# EAGLE schematic Microduino-NEO6M (EAGLE 6.3)
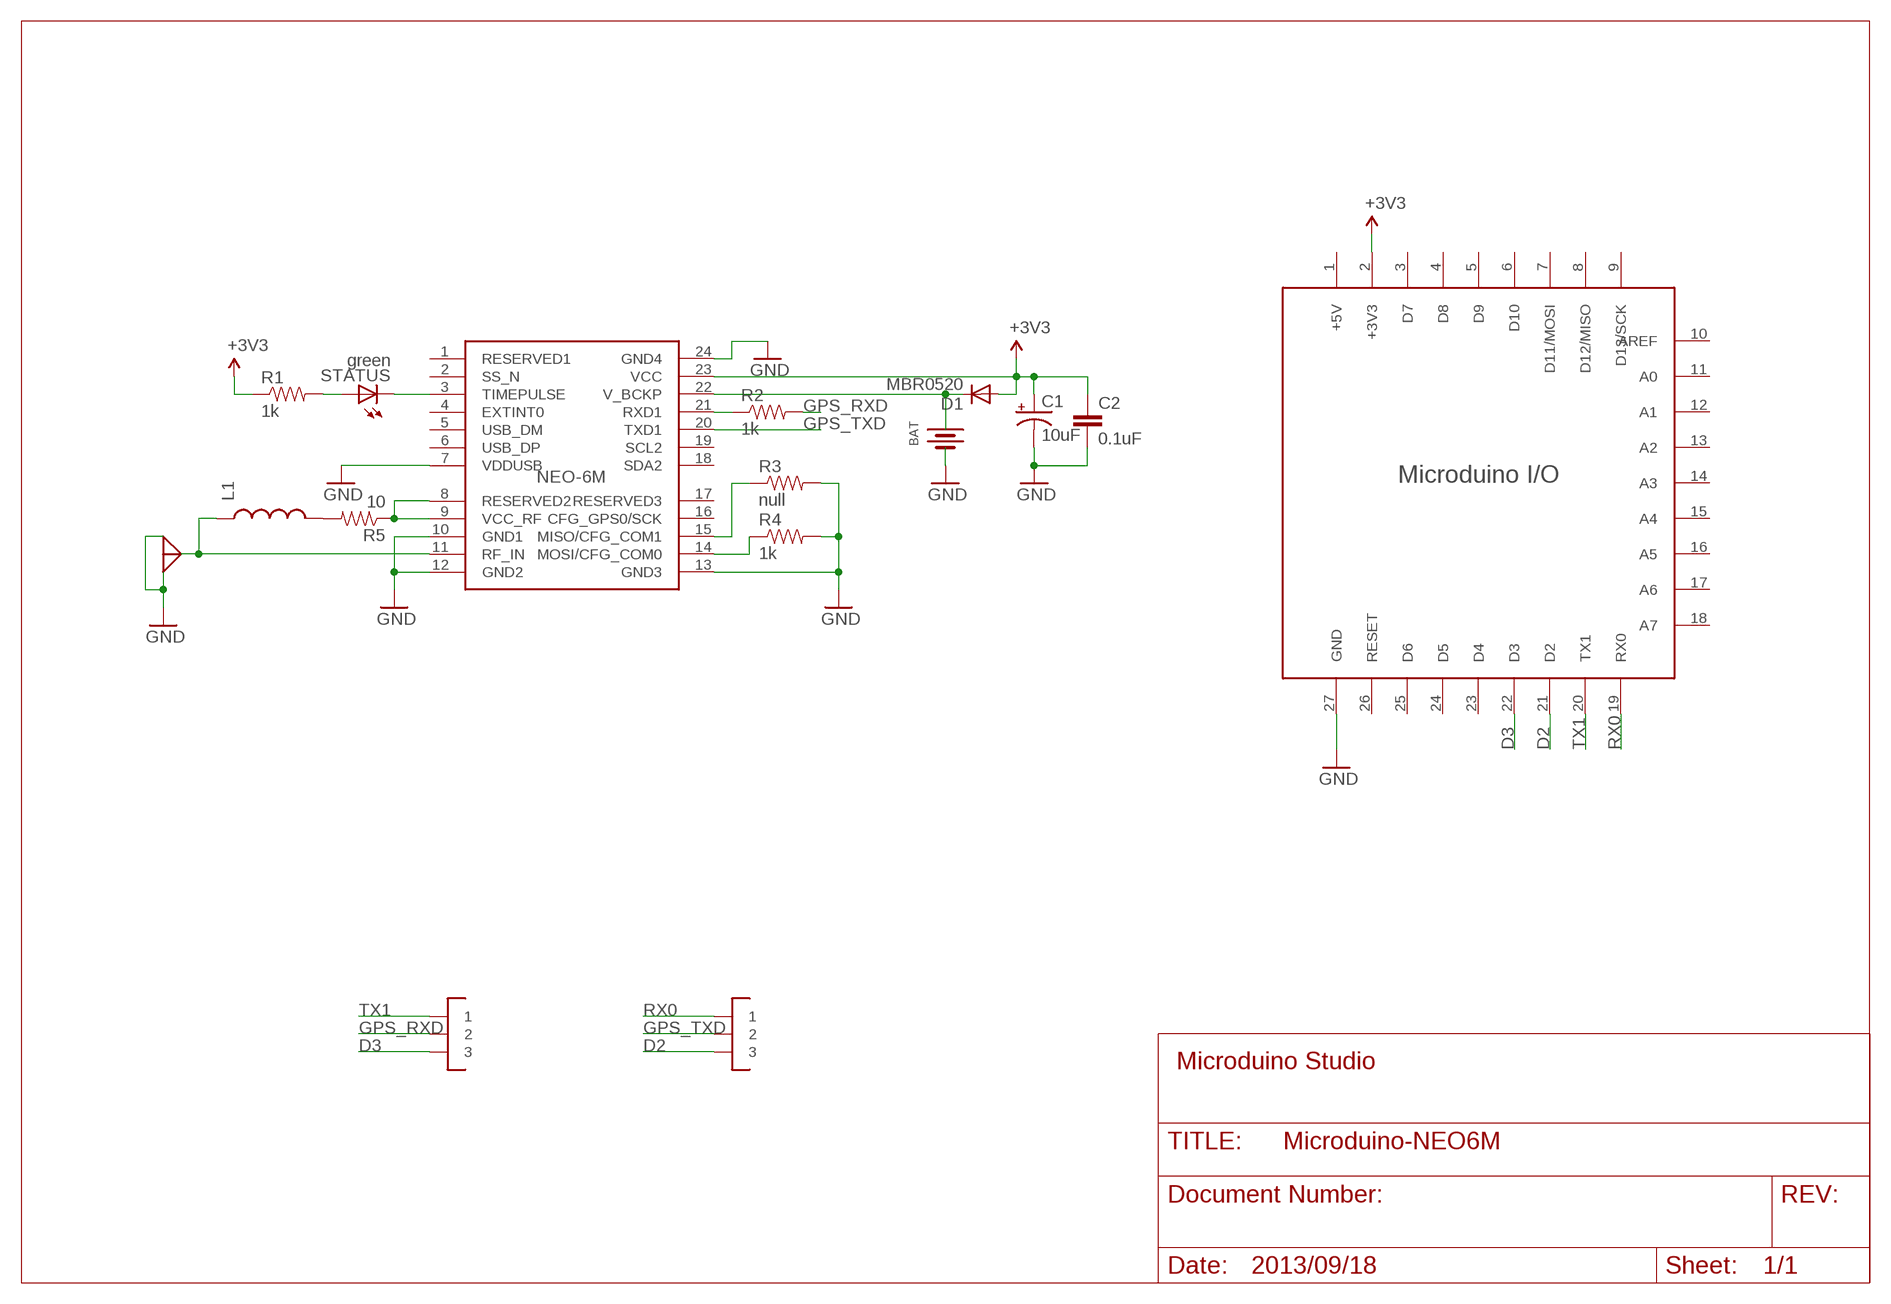
[diagram p0: schematic, sheet 1]

## Parts
BAT  XH414  BATTERY-TS414H  [TS414H]
C1  10uF  CAP_POL3528  [EIA3528]
C2  0.1uF  CAP0603-CAP  [0603-CAP]
D1  MBR0520  DIODE-SOD123  [SOD123]
IPEX  ANT-UMCC  [UMCC]
L1  INDUCTOR0603  [0603]
R1  1k  RESISTOR0603-RES  [0603-RES]
R2  1k  RESISTOR0603-RES  [0603-RES]
R3  null  RESISTOR0603-RES  [0603-RES]
R4  1k  RESISTOR0603-RES  [0603-RES]
R5  10  RESISTOR0603-RES  [0603-RES]
STATUS  green  LED0805  [0805-LED]
U$1  PING-MICRDUINO/1009  [PIN-MICRODUINO-1009]
U$2  BLOX-NEO-6M  [NE0-6M]
U$3  JUMPER1-2  [JUMPER1-2]
U$4  JUMPER1-2  [JUMPER1-2]

## Nets
+3V3: C1.A(+) C2.1 D1.A R1.1 U$1.2(+3V3) U$2.23(VCC)
D2: U$1.21(D2) U$4.3
D3: U$1.22(D3) U$3.3
GND: BAT.2(-) C1.C(-) C2.2 IPEX.1(GND1) IPEX.2(GND2) R3.2 R4.2 U$1.27(GND) U$2.7(VDDUSB) U$2.10(GND1) U$2.12(GND2) U$2.13(GND3) U$2.24(GND4)
GPS_RXD: R2.2 U$3.2
GPS_TXD: U$2.20(TXD1) U$4.2
N$1: R1.2 STATUS.A
N$2: STATUS.C U$2.3(TIMEPULSE)
N$4: IPEX.3(ANT) L1.1 U$2.11(RF_IN)
N$6: R2.1 U$2.21(RXD1)
N$7: R3.1 U$2.15(MISO/CFG_COM1)
N$8: R4.1 U$2.14(MOSI/CFG_COM0)
N$9: BAT.1(+) D1.C U$2.22(V_BCKP)
N$11: L1.2 R5.2
N$12: R5.1 U$2.8(RESERVED2) U$2.9(VCC_RF)
RX0: U$1.19(RX0) U$4.1
TX1: U$1.20(TX1) U$3.1
Unconnected: U$1.1(+5V) U$1.3(D7) U$1.4(D8) U$1.5(D9) U$1.6(D10) U$1.7(D11/MOSI) U$1.8(D12/MISO) U$1.9(D13/SCK) U$1.10(AREF) U$1.11(A0) U$1.12(A1) U$1.13(A2) U$1.14(A3) U$1.15(A4) U$1.16(A5) U$1.17(A6) U$1.18(A7) U$1.23(D4) U$1.24(D5) U$1.25(D6) U$1.26(RESET) U$2.1(RESERVED1) U$2.2(SS_N) U$2.4(EXTINT0) U$2.5(USB_DM) U$2.6(USB_DP) U$2.16(CFG_GPS0/SCK) U$2.17(RESERVED3) U$2.18(SDA2) U$2.19(SCL2)

## Notes on the sheet
- Microduino Studio
- 2013/09/18

## Library data of the parts
BAT = microduino:BATTERY
C1 = microduino:CAP_POL: Capacitor Polarized These are standard SMD and PTH capacitors. Normally 10uF, 47uF, and 100uF in electrolytic and tantalum varieties. Always verify the external diameter of the through hole cap, it varies with capacity, voltage, and manufacturer. The EIA devices should be standard.
C2 = microduino:CAP: Capacitor Standard 0603 ceramic capacitor, and 0.1" leaded capacitor.
D1 = microduino:DIODE-: DIODE
IPEX = microduino:ANT
L1 = microduino:INDUCTOR: Inductors Basic Inductor/Choke - 0603 and 1206. Footprints are not proven and vary greatly between part numbers.
R1-R5 = microduino:RESISTOR: Resistor Basic schematic elements and footprints for 0603, 1206, and PTH 1/10th watt (small) resistors.
STATUS = microduino:LED: LEDs Standard schematic elements and footprints for 5mm, 3mm, 1206, and 0603 sized LEDs. 5mm - Spark Fun Electronics SKU : COM-00529 (and others)
U$1 = microduino:PING-MICRDUINO: microduino引脚封装
U$2 = microduino:BLOX-NEO-6M
U$3 U$4 = microduino:JUMPER1-2